# EAGLE design Bean_revE (EAGLE 7.6.0)
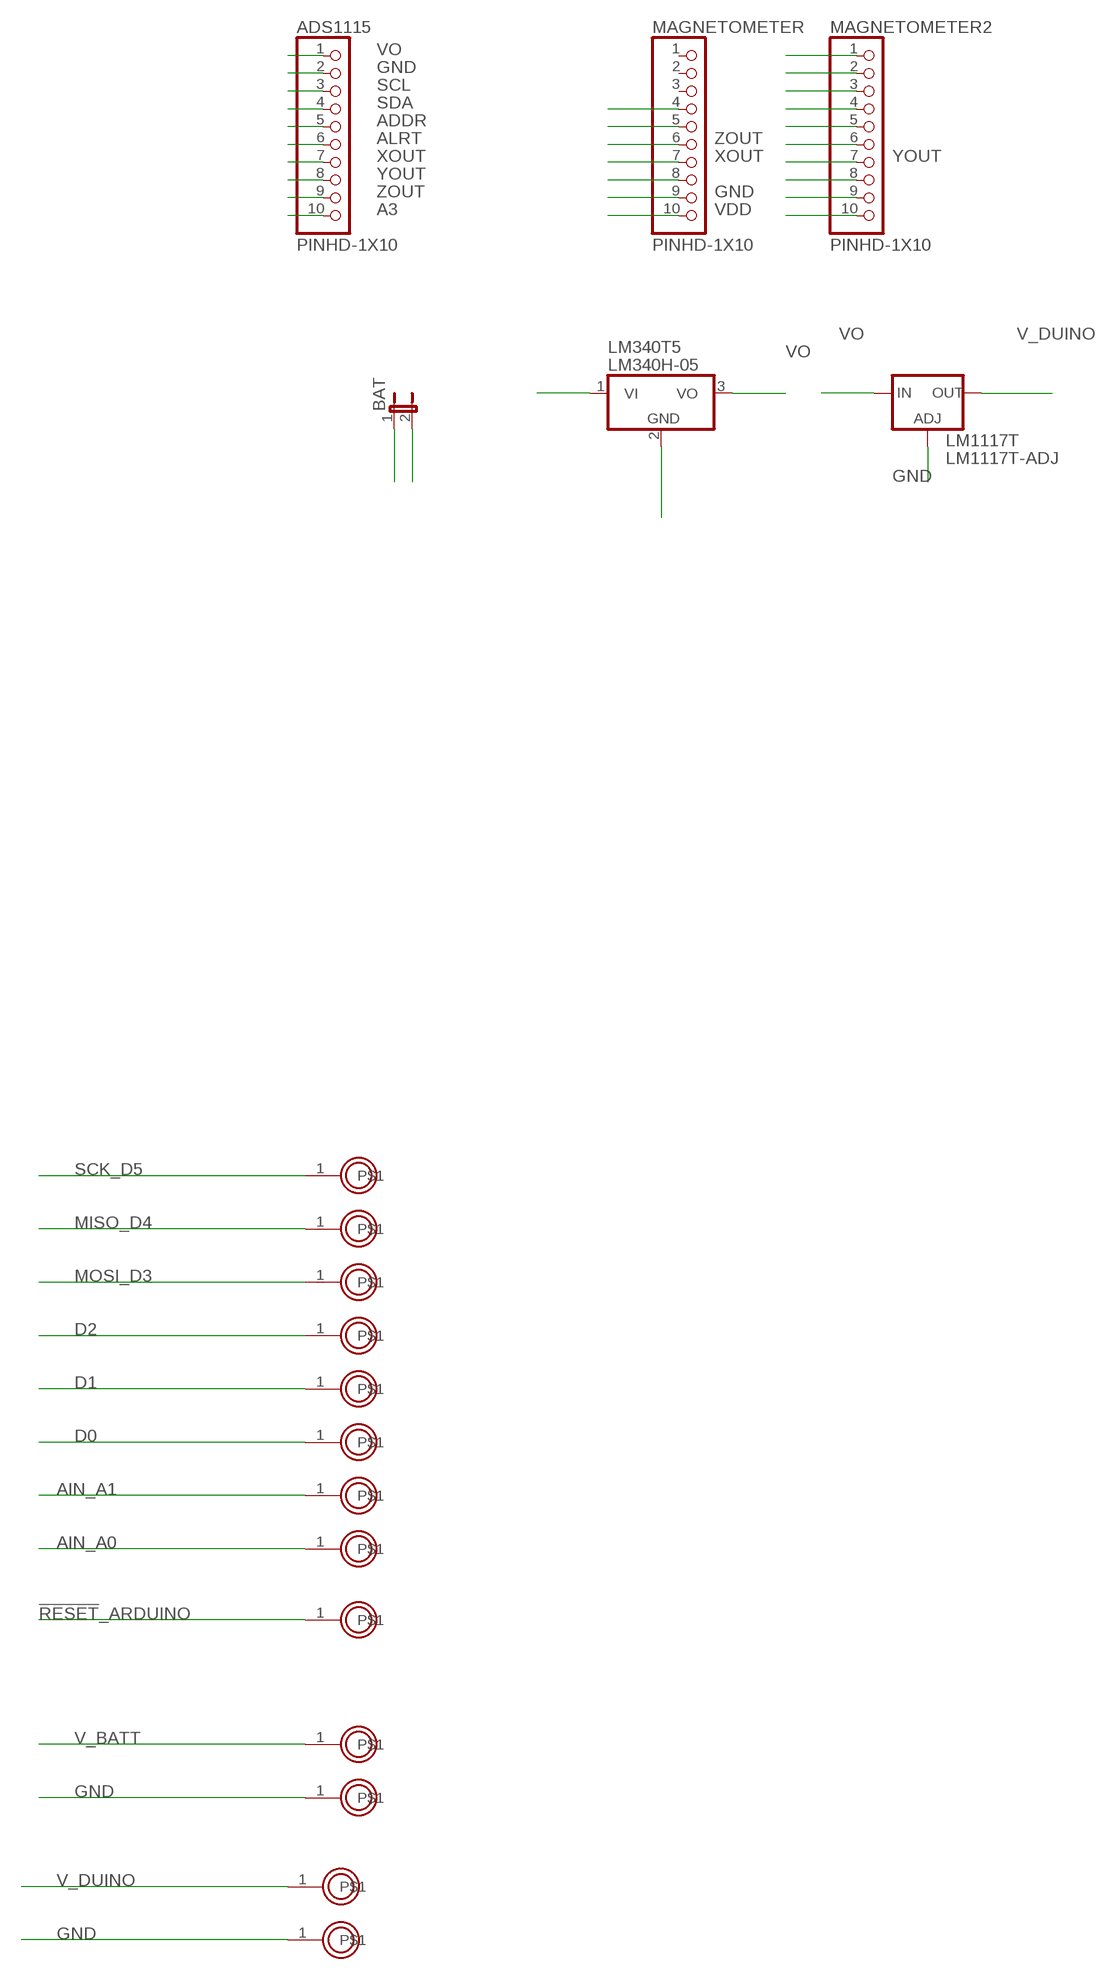
[diagram p0: schematic, sheet 1]

## Parts
ADS1115  PINHD-1X10  [1X10-BIG]
BAT  JP1E  [JP1]
LM340T5  LM340H-05  [TO220H]
LM1117T  LM1117T-ADJ  [TO220]
MAGNETOMETER  PINHD-1X10  [1X10-BIG]
MAGNETOMETER2  PINHD-1X10  [1X10-BIG]
U$1  PROTO_POINT  [1X01]
U$3  PROTO_POINT  [1X01]
U$4  PROTO_POINT  [1X01]
U$5  PROTO_POINT  [1X01]
U$6  PROTO_POINT  [1X01]
U$7  PROTO_POINT  [1X01]
U$8  PROTO_POINT  [1X01]
U$9  PROTO_POINT  [1X01]
U$10  PROTO_POINT  [1X01]
U$45  PROTO_POINT  [1X01]
U$46  PROTO_POINT  [1X01]
U$52  PROTO_POINT  [1X01]
U$53  PROTO_POINT  [1X01]

## Nets
!RESET!_ARDUINO: U$46.1
A3: ADS1115.10
ADDR: ADS1115.5
AIN_A0: U$10.1
AIN_A1: U$9.1
ALRT: ADS1115.6
D0: U$8.1
D1: U$7.1
D2: U$6.1
GND: ADS1115.2 BAT.2 LM340T5.2(GND) LM1117T.1(ADJ) MAGNETOMETER.9 U$45.1 U$53.1
MISO_D4: U$4.1
MOSI_D3: U$5.1
N$4: MAGNETOMETER.4
N$5: MAGNETOMETER.5
N$8: MAGNETOMETER.8
N$11: MAGNETOMETER2.1
N$12: MAGNETOMETER2.2
N$13: MAGNETOMETER2.3
N$14: MAGNETOMETER2.4
N$15: MAGNETOMETER2.5
N$16: MAGNETOMETER2.6
N$18: MAGNETOMETER2.9
N$19: MAGNETOMETER2.8
N$20: MAGNETOMETER2.10
SCK_D5: U$3.1
SCL: ADS1115.3
SDA: ADS1115.4
V_BATT: U$52.1
V_DUINO: LM1117T.2(OUT) U$1.1
VDD: MAGNETOMETER.10
VI: BAT.1 LM340T5.1(VI)
VO: ADS1115.1 LM340T5.3(VO) LM1117T.3(IN)
XOUT: ADS1115.7 MAGNETOMETER.7
YOUT: ADS1115.8 MAGNETOMETER2.7
ZOUT: ADS1115.9 MAGNETOMETER.6
Unconnected: MAGNETOMETER.1 MAGNETOMETER.2 MAGNETOMETER.3

## Library data of the parts
ADS1115 MAGNETOMETER MAGNETOMETER2 = adafruit:PINHD-1X10: Pin header 1x10 0.1" spacing With round pins
BAT = jumper:JP1E: JUMPER
LM340T5 = linear:LM340?-*: Positive VOLTAGE REGULATOR Source: http://cache.national.com/ds/LM/LM340.pdf
LM1117T = lm1117:LM1117T-ADJ
U$1 U$3-U$10 U$45 U$46 U$52 U$53 = BLEduino Bean:PROTO_POINT

## Board
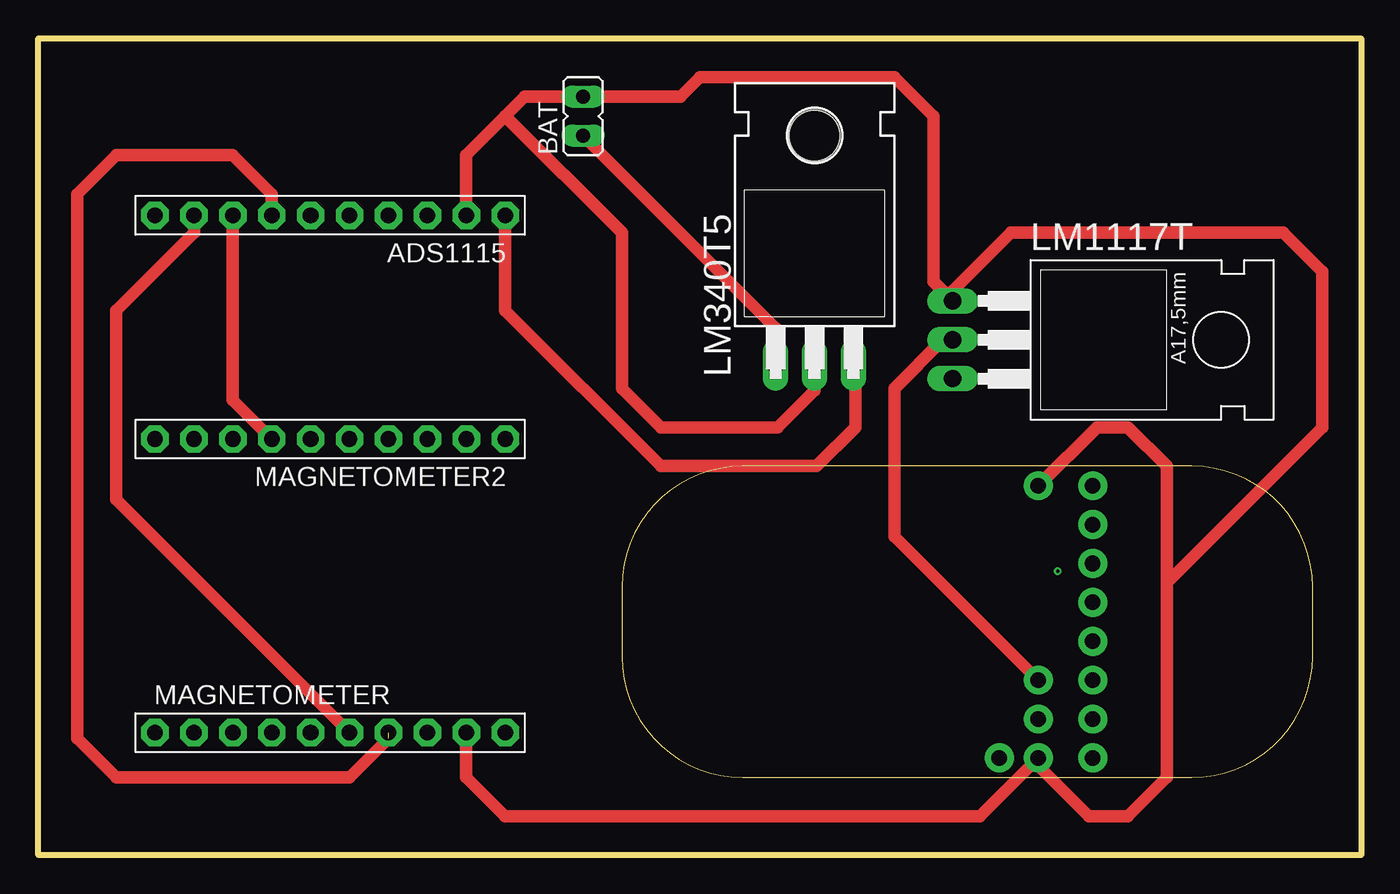
[diagram p1: board, top side]
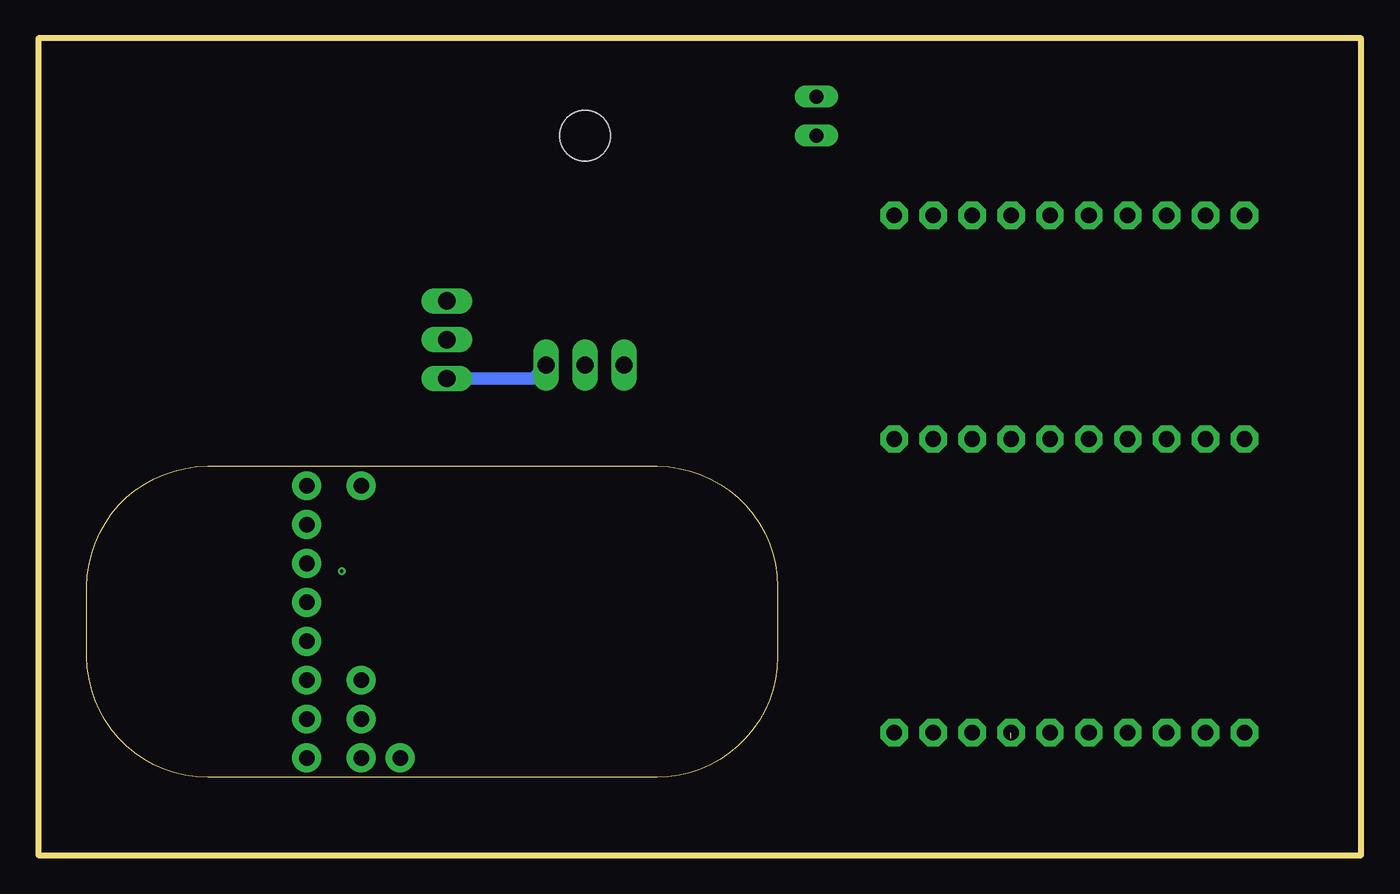
[diagram p2: board, bottom side, seen from below]

Size 86.36 x 53.34 mm. Coordinates in mm from the lower left corner, seen from the top.
Outline: 38.1,17.53 38.1,12.95 arc90 45.97,5.08 75.31,5.08 arc90 83.19,12.95 83.19,17.53 arc90 75.31,25.4 45.97,25.4 arc90 38.1,17.53
Outline: 0,0 0,53.34 86.36,53.34 86.36,0 0,0
Copper layers (1*16): Top 0.035mm / dielectric 1.5mm / Bottom 0.035mm
Design rules "default *": minimum track width 7mil, minimum drill 0.15mm, track to track 5mil, track to pad 5mil, pad to pad 5mil, via to via 5mil, smd to smd 1mil, copper to edge 8mil, drill to drill 8mil, minimum pad ring 10mil, minimum via ring 2mil, stop-mask expansion 2mil, vias tented up to drill 13mil, thermal gap 10mil
tRestrict: area 3.6,15.7 to 8.1,20.1
bRestrict: area 3.6,15.7 to 8.1,20.1; area 10.8,13.7 to 11.9,15.2; area 11.7,14.1 to 12.8,15.5; area 11.5,12.3 to 12.6,13.8; area 12.3,12.7 to 13.5,14.1; area 12.1,10.9 to 13.2,12.4; area 13,11.3 to 14.1,12.7; area 12.7,9.6 to 13.8,11; area 13.6,9.9 to 14.7,11.4; area 21.6,18.9 to 22.7,20.4; area 22.5,19.3 to 23.6,20.7; area 22.2,17.6 to 23.4,19; 22 more areas

### Footprints (pad centres in the part's own frame; a part is rotated, then mirrored left to right if it is on the bottom)
1X10-BIG = drill 1.016 pad 1.778 octagon: 1 -11.43,0; 2 -8.89,0; 3 -6.35,0; 4 -3.81,0; 5 -1.27,0; 6 1.27,0; 7 3.81,0; 8 6.35,0; 9 8.89,0; 10 11.43,0
JP1 = drill 0.914 long: 1 0,-1.27; 2 0,1.27
TO220H = drill 1.118 long: 1 -2.54,-10.16; 2 0,-10.16; 3 2.54,-10.16 | hole 3.302: 0,4.826
TO220 = drill 1.118 long: 1 -2.54,-6.35; 2 0,-6.35; 3 2.54,-6.35
1X01 = drill 1.016 pad 1.88: 1 0,0

### Placement (x,y rotation side)
ADS1115  19.05,41.78 180 top
BAT  35.56,48.26 0 top
LM340T5  50.67,42.16 0 top
LM1117T  66.04,33.66 270 top
MAGNETOMETER  19.05,8 0 top
MAGNETOMETER2  19.05,27.18 180 top
U$1  65.28,11.43 0 top
U$3  68.83,24.13 0 top
U$4  68.83,21.59 0 top
U$5  68.83,19.05 0 top
U$6  68.83,16.51 0 top
U$7  68.83,13.97 0 top
U$8  68.83,11.43 0 top
U$9  68.83,8.89 0 top
U$10  68.83,6.35 0 top
U$45  65.28,24.13 0 top
U$46  65.28,8.89 0 top
U$52  62.74,6.35 0 top
U$53  65.28,6.35 0 top

### Tracks (layer width: path | path; a pad name or v marks a point on that pad's centre or on a via)
GND
  Top 0.813: MAGNETOMETER.9 27.94,5.08 30.48,2.54 61.47,2.54 U$53.1 65.28,5.84 68.58,2.54 71.12,2.54 73.66,5.08 73.66,17.78 | 73.66,17.78 73.66,25.4 71.12,27.94 69.09,27.94 U$45.1 | 73.66,17.78 83.82,27.94 83.82,38.1 81.28,40.64 63.5,40.64 59.69,36.83 LM1117T.1 58.42,37.46 58.42,48.26 55.88,50.8 43.18,50.8 41.91,49.53 BAT.2 31.75,49.53 30.48,48.26 | 30.48,48.26 27.94,45.72 ADS1115.2 | LM340T5.2 50.67,30.35 48.26,27.94 40.64,27.94 38.1,30.48 38.1,40.64 30.48,48.26
PRE_V_BATT  (via drill 0.2 pad 0.51)
  other vias: 66.55,18.54
V_DUINO
  Top 0.813: LM1117T.2 59.05,33.66 55.88,30.48 55.88,20.83 U$1.1
VI
  Top 0.813: LM340T5.1 48.13,34.42 BAT.1
VO
  Top 0.813: ADS1115.1 30.48,35.56 40.64,25.4 50.8,25.4 53.34,27.94 53.34,31.88 LM340T5.3
  Bottom 0.813: LM1117T.3 54.1,31.12 LM340T5.3
XOUT  (1 unrouted)
  Top 0.813: ADS1115.7 15.24,43.18 12.7,45.72 5.08,45.72 2.54,43.18 2.54,7.62 5.08,5.08 20.32,5.08 22.86,7.62
YOUT
  Top 0.813: ADS1115.8 12.7,29.72 MAGNETOMETER2.7
ZOUT
  Top 0.813: ADS1115.9 10.16,40.64 5.08,35.56 5.08,23.24 MAGNETOMETER.6

### Text on the board
tArt: G / N / D | 5 | 4 | 3 | 2 | 1 | VCC | 0 | R | A1 | G / N / D | BAT | A0